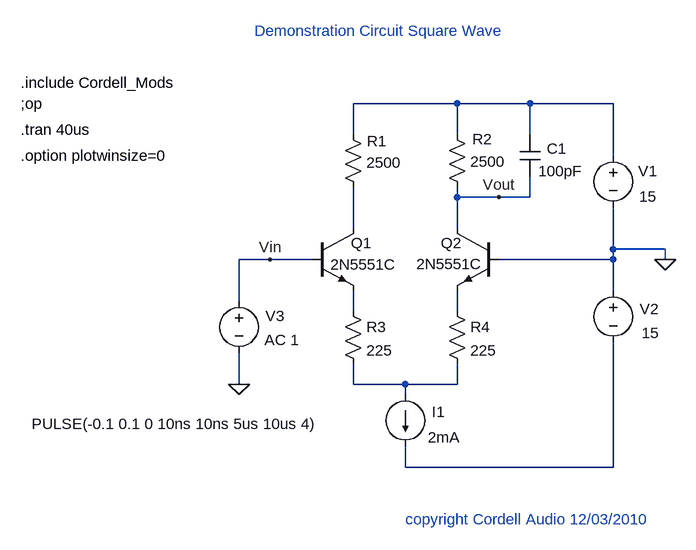
[diagram p0: schematic Demonstration circuit square.asc]
Demonstration circuit square.asc, the LTspice schematic file:
Version 4
SHEET 1 880 724
WIRE 160 64 0 64
WIRE 272 64 160 64
WIRE 400 64 272 64
WIRE 0 112 0 64
WIRE 160 112 160 64
WIRE 272 112 272 64
WIRE 400 144 400 64
WIRE 160 208 160 192
WIRE 224 208 160 208
WIRE 272 208 272 176
WIRE 272 208 224 208
WIRE 0 256 0 192
WIRE 160 256 160 208
WIRE 400 288 400 224
WIRE 480 288 400 288
WIRE -128 304 -176 304
WIRE -64 304 -128 304
WIRE 400 304 400 288
WIRE 400 304 224 304
WIRE 480 304 480 288
WIRE 400 352 400 304
WIRE -176 368 -176 304
WIRE 0 384 0 352
WIRE 160 384 160 352
WIRE -176 496 -176 448
WIRE 0 496 0 464
WIRE 80 496 0 496
WIRE 160 496 160 464
WIRE 160 496 80 496
WIRE 80 512 80 496
WIRE 80 624 80 592
WIRE 400 624 400 432
WIRE 400 624 80 624
FLAG 480 304 0
FLAG -176 496 0
FLAG -128 304 Vin
FLAG 224 208 Vout
SYMBOL res -16 96 R0
WINDOW 0 37 26 Left 0
WINDOW 3 36 59 Left 0
SYMATTR InstName R1
SYMATTR Value 2500
SYMBOL res 144 96 R0
WINDOW 0 39 23 Left 0
WINDOW 3 36 57 Left 0
SYMATTR InstName R2
SYMATTR Value 2500
SYMBOL voltage 400 128 R0
WINDOW 123 0 0 Left 0
WINDOW 39 0 0 Left 0
WINDOW 0 39 40 Left 0
WINDOW 3 40 79 Left 0
SYMATTR InstName V1
SYMATTR Value 15
SYMBOL voltage 400 336 R0
WINDOW 123 0 0 Left 0
WINDOW 39 0 0 Left 0
WINDOW 0 41 44 Left 0
WINDOW 3 44 81 Left 0
SYMATTR InstName V2
SYMATTR Value 15
SYMBOL npn -64 256 R0
WINDOW 0 60 23 Left 0
WINDOW 3 29 56 Left 0
SYMATTR InstName Q1
SYMATTR Value 2N5551C
SYMBOL npn 224 256 M0
WINDOW 0 57 23 Left 0
WINDOW 3 25 55 Left 0
SYMATTR InstName Q2
SYMATTR Value 2N5551C
SYMBOL res -16 368 R0
SYMATTR InstName R3
SYMATTR Value 225
SYMBOL res 144 368 R0
SYMATTR InstName R4
SYMATTR Value 225
SYMBOL current 80 512 R0
WINDOW 123 0 0 Left 0
WINDOW 39 0 0 Left 0
WINDOW 0 41 27 Left 0
WINDOW 3 35 66 Left 0
SYMATTR InstName I1
SYMATTR Value 2mA
SYMBOL voltage -176 352 R0
WINDOW 3 -319 205 Left 0
WINDOW 123 39 76 Left 0
WINDOW 39 0 0 Left 0
WINDOW 0 41 39 Left 0
SYMATTR Value PULSE(-0.1 0.1 0 10ns 10ns 5us 10us 4)
SYMATTR Value2 AC 1
SYMATTR InstName V3
SYMBOL cap 256 112 R0
WINDOW 3 29 56 Left 0
WINDOW 0 42 21 Left 0
SYMATTR Value 100pF
SYMATTR InstName C1
TEXT -512 64 Left 0 !;op
TEXT -512 104 Left 0 !.tran 40us
TEXT -152 -48 Left 0 ;Demonstration Circuit Square Wave
TEXT -512 144 Left 0 !.option plotwinsize=0
TEXT 80 704 Left 0 ;copyright Cordell Audio 12/03/2010
TEXT -512 32 Left 0 !.include Cordell_Mods

The netlist it stands for:
* Demonstration circuit square.asc
R1 N001 N002 2500
R2 N001 Vout 2500
V1 N001 0 15
V2 0 N006 15
Q1 N002 Vin N003 0 2N5551C
Q2 Vout 0 N004 0 2N5551C
R3 N003 N005 225
R4 N004 N005 225
I1 N005 N006 2mA
V3 Vin 0 PULSE(-0.1 0.1 0 10ns 10ns 5us 10us 4) AC 1
C1 N001 Vout 100pF
.model NPN NPN
.model PNP PNP
.lib standard.bjt
;op
.tran 40us
* Demonstration Circuit Square Wave
.option plotwinsize=0
* copyright Cordell Audio 12/03/2010
.include Cordell_Mods
.backanno
.end